# EAGLE design SHIELD_COMPLETO (EAGLE 9.6.2)
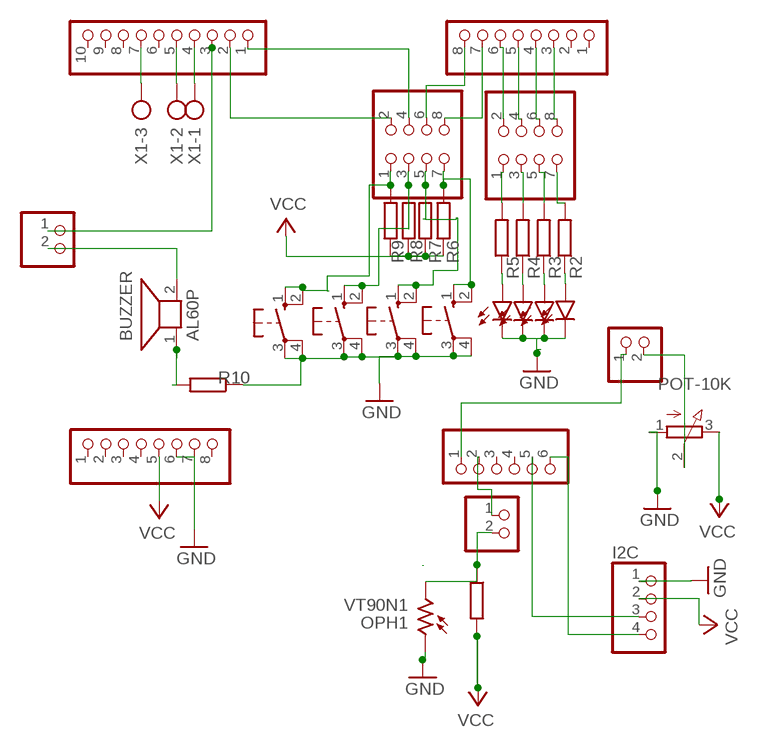
[diagram p0: schematic, sheet 1]

## Parts
AD  6x1F-H8.5  PINHD-1X6  [1X06]
BOT1  10-XX  [B3F-10XX]
BOT2  10-XX  [B3F-10XX]
BOT3  10-XX  [B3F-10XX]
BOT4  10-XX  [B3F-10XX]
BUZZER  AL60P  [AL60P]
I2C  PINHD-1X4  [1X04]
IOH  10x1F-H8.5  PINHD-1X10_ARD  [1X10]
IOL  8x1F-H8.5  PINHD-1X8  [1X08]
J10  PINHD-1X2  [1X02]
JP1  PINHD-2X4  [2X04]
JP2  PINHD-2X4  [2X04]
JP3  PINHD-1X2  [1X02]
JP4  PINHD-1X2  [1X02]
LED1  LED5MM  [LED5MM]
LED2  LED5MM  [LED5MM]
LED3  LED5MM  [LED5MM]
LED4  LED5MM  [LED5MM]
OPH1  VT90N1  [VT900]
POT-10K  3RP/1610N  [3RP/1610N]
POWER  8x1F-H8.5  PINHD-1X8  [1X08]
R1  R-EU_0204/7  [0204/7]
R2  R-EU_0204/7  [0204/7]
R3  R-EU_0204/7  [0204/7]
R4  R-EU_0204/7  [0204/7]
R5  R-EU_0204/7  [0204/7]
R6  R-EU_0204/7  [0204/7]
R7  R-EU_0204/7  [0204/7]
R8  R-EU_0204/7  [0204/7]
R9  R-EU_0204/7  [0204/7]
R10  R-EU_0204/7  [0204/7]
X1  AK300/3  [AK300/3]

## Nets
GND: BOT1.3(P) BOT1.4(P1) BOT2.3(P) BOT2.4(P1) BOT3.3(P) BOT3.4(P1) BOT4.3(P) BOT4.4(P1) I2C.1 LED1.K(C) LED2.K(C) LED3.K(C) LED4.K(C) OPH1.1 POT-10K.1(A) POWER.6 POWER.7 R10.1
N$1: JP1.1 R5.2
N$2: IOL.3 JP1.8
N$3: IOL.4 JP1.6
N$4: IOL.5 JP1.4
N$5: IOL.6 JP1.2
N$6: JP1.3 R4.2
N$7: JP1.5 R3.2
N$8: JP1.7 R2.2
N$9: LED1.A R2.1
N$10: LED2.A R3.1
N$11: LED3.A R4.1
N$12: LED4.A R5.1
N$13: IOL.7 JP2.8
N$14: IOL.8 JP2.6
N$15: IOH.1 JP2.4
N$16: IOH.2 JP2.2
N$17: JP4.2 POT-10K.2(S)
N$18: BOT1.1(S) BOT1.2(S1) JP2.7 R6.2
N$19: JP3.2 OPH1.2 R1.1
N$20: AD.2 JP3.1
N$21: BOT4.1(S) BOT4.2(S1) JP2.1 R9.2
N$22: BOT3.1(S) BOT3.2(S1) JP2.3 R8.2
N$23: BOT2.1(S) BOT2.2(S1) JP2.5 R7.2
N$24: BUZZER.1 R10.2
N$25: IOH.7 X1.3
N$26: IOH.3 J10.1
N$27: IOH.5 X1.2
N$28: AD.5 I2C.3
N$29: AD.6 I2C.4
N$30: AD.1 JP4.1
N$32: IOH.4 X1.1
N$34: BUZZER.2 J10.2
VCC: I2C.2 POT-10K.3(E) POWER.5 R1.2 R6.1 R7.1 R8.1 R9.1
Unconnected: AD.3 AD.4 IOH.6 IOH.8 IOH.9 IOH.10 IOL.1 IOL.2 POWER.1 POWER.2 POWER.3 POWER.4 POWER.8

## Library data of the parts
AD = SmartPrj:PINHD-1X6: PIN HEADER
BOT1-BOT4 = switch-omron:10-XX: OMRON SWITCH; MPN: B3F-1000; OC_FARNELL: 176432; OC_NEWARK: 36M3542
BUZZER = buzzer:AL60P: SPEAKER Source: Buerklin; OC_FARNELL: unknown; OC_NEWARK: unknown
I2C = pinhead:PINHD-1X4: PIN HEADER
IOH = SmartPrj:PINHD-1X10_ARD: PIN HEADER
IOL POWER = SmartPrj:PINHD-1X8: PIN HEADER
J10 JP3 JP4 = pinhead:PINHD-1X2: PIN HEADER
JP1 JP2 = pinhead:PINHD-2X4: PIN HEADER
LED1-LED4 = led:LED: LED OSRAM: - CHIPLED LG R971, LG N971, LY N971, LG Q971, LY Q971, LO R971, LY R971 LH N974, LH R974 LS Q976, LO Q976, LY Q976 LO Q996 - Hyper CHIPLED LW Q18S LB Q993, LB Q99A, LB R99A - SideLED LS A670, LO A670, LY A670, LG A670, LP A670 LB A673, LV A673, LT A673, LW A673 LH A674 LY A675 LS A676, LA A676, LO A676, LY A676, LW A676 LS A679, LY A679, LG A679 - Hyper Micro SIDELED® LS Y876, LA Y876, LO Y876, LY Y876 LT Y87S - SmartLED LW L88C, LW L88S LB L89C, LB L89S, LG L890 LS L89K, LO L89K, LY L89K LS L896, LA L896, LO L896, LY L896 - TOPLED LS T670, LO T670, LY T670, LG T670, LP T670 LSG T670, LSP T670, LSY T670, LOP T670, LYG T670 LG T671, LOG T671, LSG T671 LB T673, LV T673, LT T673, LW T673 LH T674 LS T676, LA T676, LO T676, LY T676, LB T676, LH T676, LSB T676, LW T676 LB T67C, LV T67C, LT T67C, LS T67K, LO T67K, LY T67K, LW E67C LS E67B, LA E67B, LO E67B, LY E67B, LB E67C, LV E67C, LT E67C LW T67C LS T679, LY T679, LG T679 LS T770, LO T770, LY T770, LG T770, LP T770 LB T773, LV T773, LT T773, LW T773 LH T774 LS E675, LA E675, LY E675, LS T675 LS T776, LA T776, LO T776, LY T776, LB T776 LHGB T686 LT T68C, LB T68C - Hyper Mini TOPLED® LB M676 - Mini TOPLED Santana® LG M470 LS M47K, LO M47K, LY M47K Source: http://www.osram.convergy.de LUXEON: - LUMILED® LXK2-PW12-R00, LXK2-PW12-S00, LXK2-PW14-U00, LXK2-PW14-V00 LXK2-PM12-R00, LXK2-PM12-S00, LXK2-PM14-U00 LXK2-PE12-Q00, LXK2-PE12-R00, LXK2-PE12-S00, LXK2-PE14-T00, LXK2-PE14-U00 LXK2-PB12-K00, LXK2-PB12-L00, LXK2-PB12-M00, LXK2-PB14-N00, LXK2-PB14-P00, LXK2-PB14-Q00 LXK2-PR12-L00, LXK2-PR12-M00, LXK2-PR14-Q00, LXK2-PR14-R00 LXK2-PD12-Q00, LXK2-PD12-R00, LXK2-PD12-S00 LXK2-PH12-R00, LXK2-PH12-S00 LXK2-PL12-P00, LXK2-PL12-Q00, LXK2-PL12-R00 Source: www.luxeon.com KINGBRIGHT: KA-3528ASYC Source: www.kingbright.com
OPH1 = photo-elements:VT9: Photoconductive Cell VT900 Series Source: http://optoelectronics.perkinelmer.com/content/Datasheets/DTS_vt900seriesdatasheet.pdf
POT-10K = pot:3RP/1610N: 16mm Potentiometer one level Source: http://www.alphapotentiometers.net/html/16mm_pot_2.html
R1-R10 = rcl:R-EU_: RESISTOR, European symbol; SPICEPREFIX: R
X1 = con-ptr500:AK300/3: CONNECTOR; OC_FARNELL: unknown; OC_NEWARK: unknown

## Net classes
0 default: width 0.254 mm, clearance 0.254 mm
1 power: width 0.61 mm, drill 0.61 mm, clearance 0.254 mm
2 gnd: width 0.305 mm, drill 0.559 mm, clearance 0.254 mm
3 usbvcc: width 0.508 mm, drill 0.61 mm, clearance 0.254 mm
4 aref: width 0.406 mm, drill 0.61 mm, clearance 0.254 mm

## Board
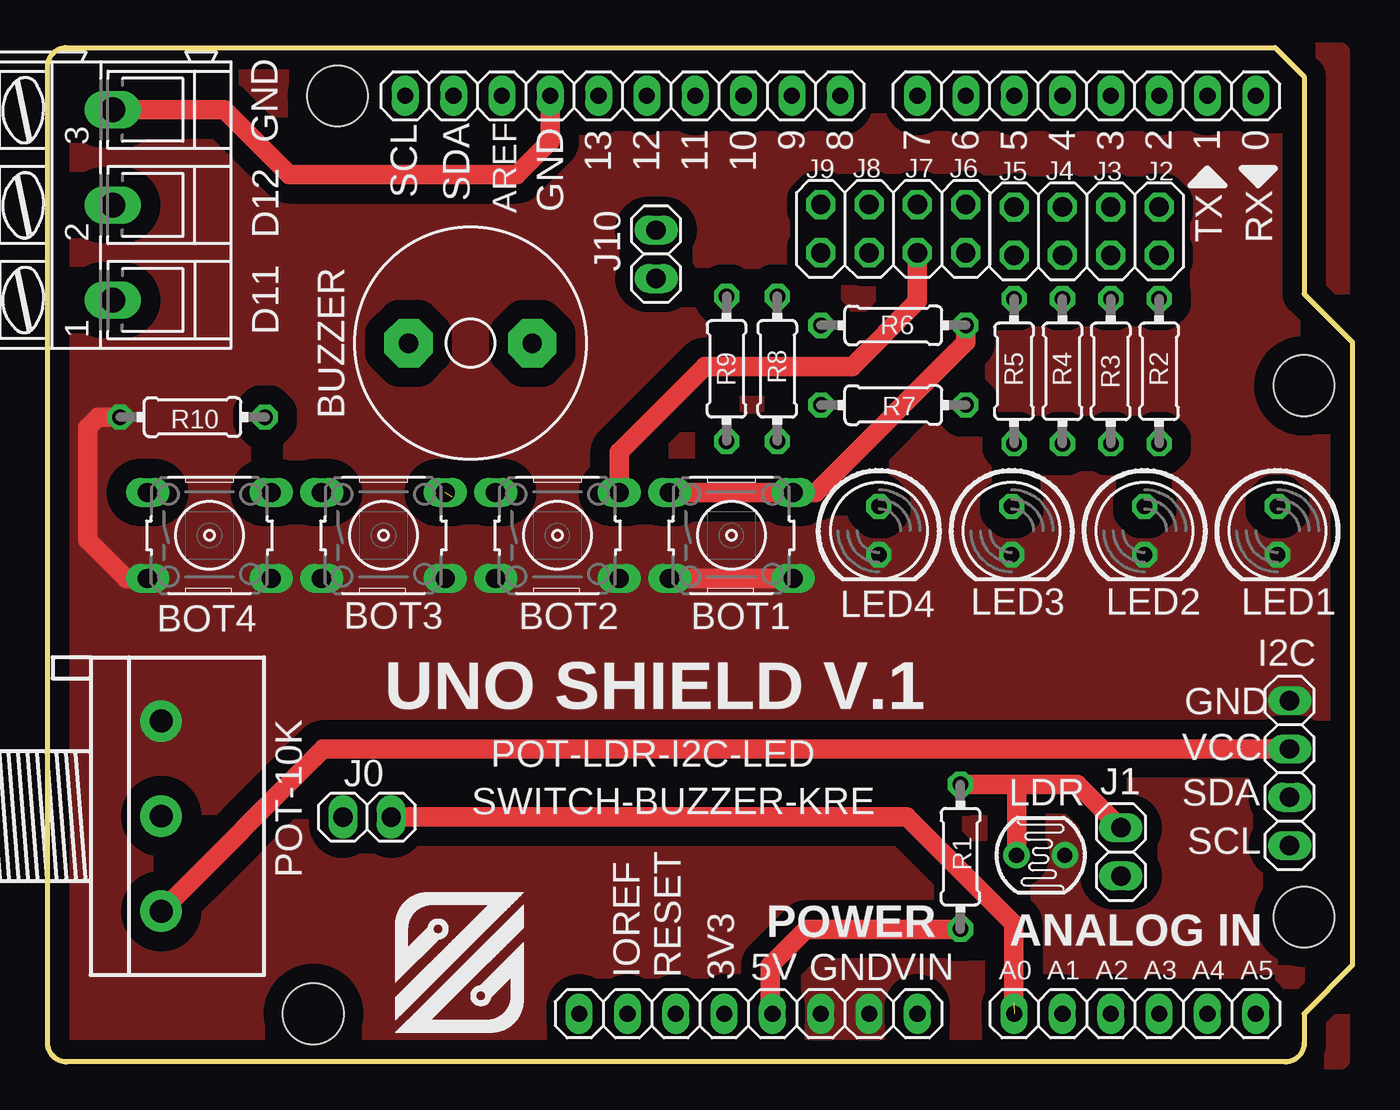
[diagram p1: board, top side]
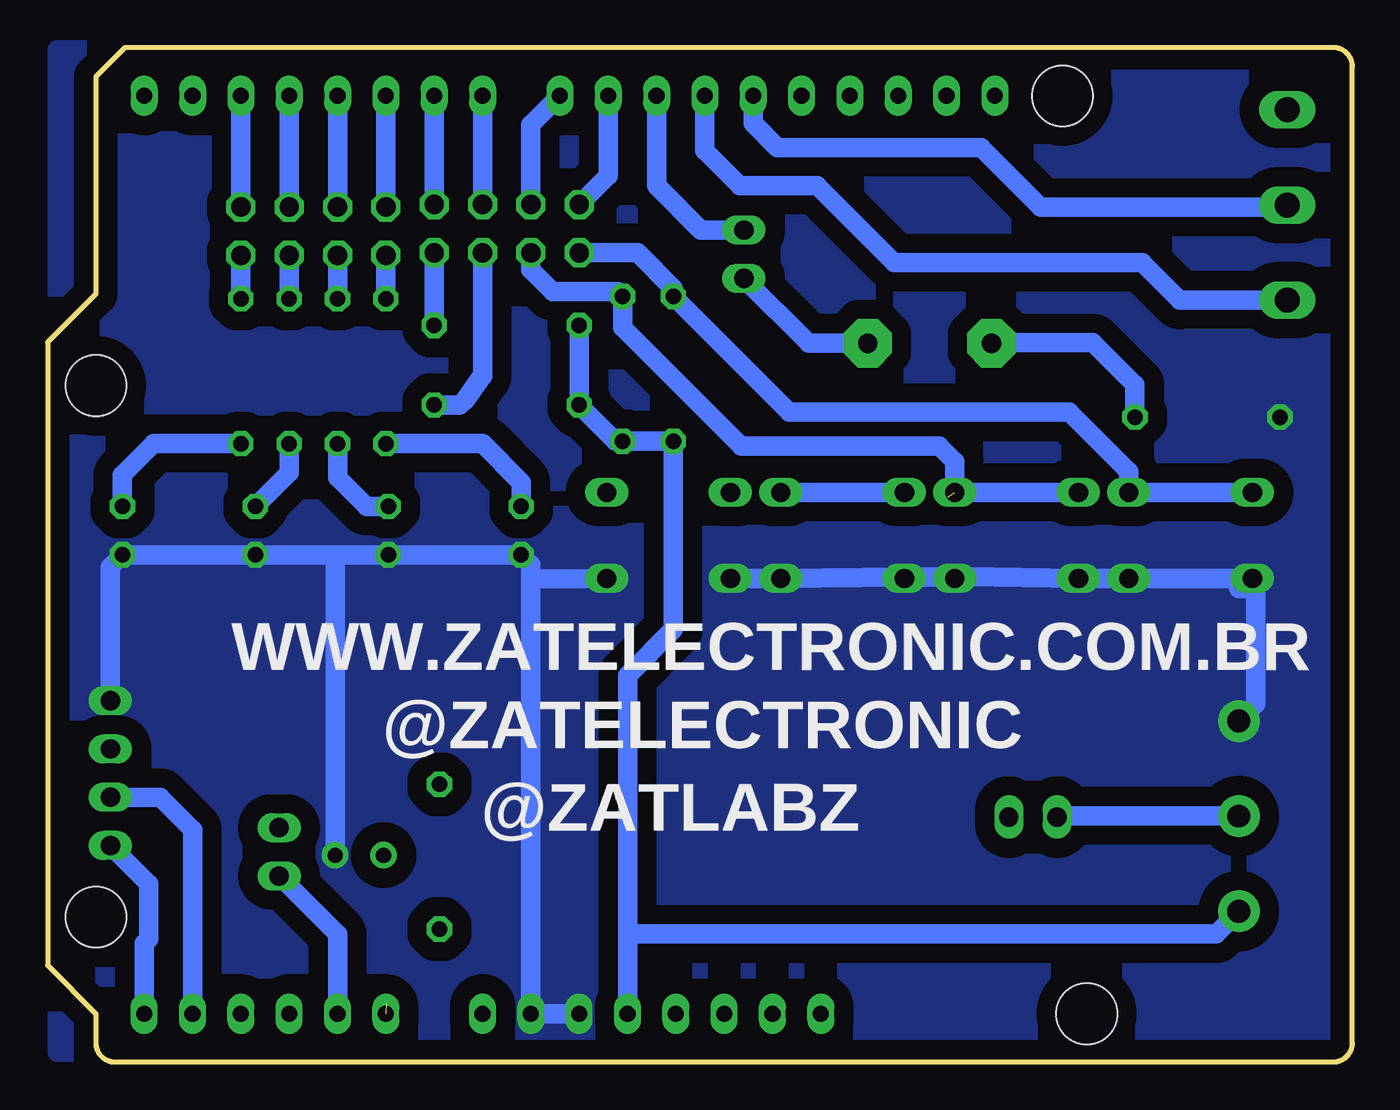
[diagram p2: board, bottom side, seen from below]

Size 68.58 x 53.34 mm. Coordinates in mm from the lower left corner, seen from the top.
Outline: 64.52,53.34 66.04,51.82 66.04,40.39 68.58,37.85 68.58,5.08 66.04,2.54 66.04,1 arc-90 65.04,0 1,0 arc-90 0,1 0,52.34 arc-90 1,53.34 64.52,53.34
Copper layers (1*16): Top 0.035mm / dielectric 1.5mm / Bottom 0.035mm
Design rules "default *": minimum track width 40mil, minimum drill 22mil, track to track 10mil, track to pad 10mil, pad to pad 10mil, via to via 12mil, smd to smd 8mil, copper to edge 26mil, drill to drill 12mil, minimum pad ring 10mil, minimum via ring 10mil, stop-mask expansion 1mil, vias tented up to drill 30mil, thermal gap 10mil
Holes 3.2 mm at 66.04,35.56 66.04,7.62 15.24,50.8 13.97,2.54

### Footprints (pad centres in the part's own frame; a part is rotated, then mirrored left to right if it is on the bottom)
1X06 = drill 0.85 pad 1.422 long: 1 -6.35,0; 2 -3.81,0; 3 -1.27,0; 4 1.27,0; 5 3.81,0; 6 6.35,0
B3F-10XX = drill 1.016 long: 1 -3.251,2.261; 2 3.251,2.261; 3 -3.251,-2.261; 4 3.251,-2.261
AL60P = drill 1.016 pad 2.54 octagon: 1 -3.251,0; 2 3.251,0
1X04 = drill 1.016 long: 1 -3.81,0; 2 -1.27,0; 3 1.27,0; 4 3.81,0
1X10 = drill 0.85 pad 1.422 long: 1 -11.43,0; 2 -8.89,0; 3 -6.35,0; 4 -3.81,0; 5 -1.27,0; 6 1.27,0; 7 3.81,0; 8 6.35,0; 9 8.89,0; 10 11.43,0
1X08 = drill 0.85 pad 1.422 long: 1 -8.89,0; 2 -6.35,0; 3 -3.81,0; 4 -1.27,0; 5 1.27,0; 6 3.81,0; 7 6.35,0; 8 8.89,0
1X02 = drill 1.016 long: 1 -1.27,0; 2 1.27,0
2X04 = drill 1.016 octagon: 1 -3.81,-1.27; 2 -3.81,1.27; 3 -1.27,-1.27; 4 -1.27,1.27; 5 1.27,-1.27; 6 1.27,1.27; 7 3.81,-1.27; 8 3.81,1.27
LED5MM = drill 0.813 octagon: A -1.27,0; K 1.27,0
VT900 = drill 0.8 pad 1.4: 1 -1.27,0; 2 1.27,0
3RP/1610N = drill 1.2 pad 2.184: 1 -5,0; 2 0,0; 3 5,0
0204/7 = drill 0.813 octagon: 1 -3.81,0; 2 3.81,0
AK300/3 = drill 1.321 long: 1 -5.004,0; 2 0,0; 3 5.004,0

### Placement (x,y rotation side)
AD  57.15,2.54 0 top
BOT1  35.94,27.69 0 top
BOT2  26.8,27.69 0 top
BOT3  17.65,27.69 0 top
BOT4  8.51,27.69 0 top
BUZZER  22.23,37.8 0 top
I2C  65.28,15.19 270 top
IOH  30.23,50.8 180 top
IOL  54.61,50.8 180 top
J10  31.98,42.47 270 top
JP1  54.61,43.69 0 top
JP2  44.45,43.81 0 top
JP3  56.41,11.05 90 top
JP4  16.79,12.88 180 top
LED1  64.64,27.94 270 top
LED2  57.66,27.94 270 top
LED3  50.67,27.94 270 top
LED4  43.69,27.94 270 top
OPH1  52.2,10.87 180 top
POT-10K  5.97,12.93 270 top
POWER  36.83,2.54 0 top
R1  47.98,10.79 270 top
R2  58.42,36.32 90 top
R3  55.88,36.32 90 top
R4  53.34,36.32 90 top
R5  50.8,36.32 90 top
R6  44.45,38.73 0 top
R7  44.45,34.54 0 top
R8  38.35,36.45 90 top
R9  35.69,36.45 90 top
R10  7.62,33.91 0 top
U$1  [SIMBOLO_MEDIO]  17.88,0.94 0 top
X1  3.43,45.06 90 top

### Tracks (layer width: path | path; a pad name or v marks a point on that pad's centre or on a via)
GND
  Top 1.016: BOT1.3 BOT1.4 | R10.1 2.67,33.91 2.11,33.35 2.11,27.46 4.14,25.43 BOT4.3
  Bottom 1.016: 53.67,26.67 LED3.K LED4.K 43.18,26.16 43.18,25.4 | 53.67,26.67 54.85,26.67 | 54.48,26.67 LED2.K LED1.K 65.28,26.04 I2C.1 | 43.18,25.4 POWER.7 POWER.6 | BOT4.3 BOT4.4 BOT3.3 20.32,25.53 BOT3.4 | BOT2.3 21.46,25.53 BOT2.4 BOT1.3 | BOT1.4 43.18,25.4 | POT-10K.1 5.08,18.82 5.08,24.89 5.97,24.89 | OPH1.1 53.47,26.47 53.67,26.67
  pour Bottom (isolate 1.016, no thermals): 0.38,53.21 0.38,0.51 68.07,0.51 68.07,53.21
  pour Top (isolate 1.016, no thermals): 0.25,53.09 0.25,0.13 67.94,0.13 67.94,53.09
N$1
  Bottom 1.016: JP1.1 R5.2
N$2
  Bottom 1.016: IOL.3 JP1.8
N$3
  Bottom 1.016: JP1.6 IOL.4
N$4
  Bottom 1.016: JP1.4 IOL.5
N$5
  Bottom 1.016: JP1.2 IOL.6
N$6
  Bottom 1.016: JP1.3 R4.2
N$7
  Bottom 1.016: JP1.5 R3.2
N$8
  Bottom 1.016: JP1.7 R2.2
N$9
  Bottom 1.016: R2.1 62.99,32.51 64.64,30.86 LED1.A
N$10
  Bottom 1.016: LED2.A 55.88,30.99 R3.1
N$11
  Bottom 1.016: LED3.A 51.82,29.21 53.34,30.73 R4.1
N$12
  Bottom 1.016: LED4.A 43.69,30.48 45.72,32.51 R5.1
N$13
  Bottom 1.016: JP2.8 IOL.7
N$14
  Bottom 1.016: JP2.6 IOL.8
N$15
  Bottom 1.016: JP2.4 43.18,49.28 IOH.1
N$16
  Bottom 1.016: JP2.2 39.12,46.61 IOH.2
N$17
  Bottom 1.016: POT-10K.2 15.47,12.93 JP4.2
N$18
  Top 1.016: R6.2 48.26,37.85 40.36,29.95 BOT1.2 BOT1.1
  Bottom 1.016: R6.2 JP2.7
N$19
  Top 1.016: JP3.2 54.13,14.61 R1.1 50.93,14.61 OPH1.2
N$20
  Bottom 1.016: AD.2 53.34,6.71 JP3.1
N$21
  Bottom 1.016: JP2.1 37.57,42.55 35.69,40.66 R9.2 29.59,34.16 14.88,34.16 11.76,31.04 BOT4.2 BOT4.1
N$22  (1 unrouted)
  Bottom 1.016: JP2.3 43.18,41.66 42.04,40.51 38.61,40.51 R8.2 38.35,38.61 32.13,32.38 21.72,32.38 20.9,31.57 BOT3.2 | BOT3.1 21.03,29.95 21.26,29.72
N$23
  Top 1.016: BOT2.2 30.05,32.08 34.54,36.58 42.29,36.58 45.72,40.01 JP2.5
  Bottom 1.016: R7.2 46.91,34.54 46.64,34.81 45.85,35.94 45.72,36.07 JP2.5 | BOT2.1 BOT2.2
N$24
  Bottom 1.016: R10.2 11.43,35.61 13.64,37.82 18.95,37.82 BUZZER.1
N$25
  Top 1.016: X1.3 9.3,50.06 12.7,46.66 24.66,46.66 26.42,48.41 IOH.7
N$26
  Bottom 1.016: J10.1 34.24,43.74 36.58,46.08 IOH.3
N$27
  Bottom 1.016: X1.2 3.53,44.96 16.38,44.96 19.51,48.08 30.23,48.08 31.5,49.35 IOH.5
N$28
  Bottom 1.016: AD.5 60.96,12.22 62.66,13.92 I2C.3
N$29
  Bottom 1.016: AD.6 63.5,6.25 63.27,6.47 63.27,9.37 I2C.4
N$30  (1 unrouted)
  Top 1.016: JP4.1 45.16,12.88 50.77,7.26 50.77,3.07
N$32
  Bottom 1.016: X1.1 9.07,40.06 11.05,42.04 24.08,42.04 28.12,46.08 32.21,46.08 34.04,47.9 IOH.4
N$34
  Bottom 1.016: BUZZER.2 28.57,37.8 J10.2
VCC
  Top 1.016: POWER.5 37.97,2.67 37.97,5.08 39.88,6.99 R1.2 | I2C.2 14.5,16.46 POT-10K.3
  Bottom 1.016: R6.1 R7.1 38.73,32.64 R8.1 R9.1 35.69,22.73 38.1,20.32 38.1,6.73 | POWER.5 38.1,6.73 | 38.1,6.73 7.17,6.73 POT-10K.3

### Text on the board
tPlace: 13 | 12 | 11 | 10 | 9 | 8 | 7 | 6 | 5 | 4 | 3 | 2 | 1 | 0
tNames: AREF | GND | GND | J9 | J8 | J7 | J6 | J5 | J4 | J3 | J2 | SCL | SDA | D12 | TX | RX | D11 | I2C | UNO SHIELD V.1 | GND | POT-LDR-I2C-LED | VCC | J0 | J1 | SWITCH-BUZZER-KRE | LDR | SDA | SCL | ANALOG IN | IOREF | RESET | 3V3 | 5V | GND | VIN | A0 | A1 | A2 | A3 | A4 | A5
bNames: WWW.ZATELECTRONIC.COM.BR | @ZATELECTRONIC | @ZATLABZ
214bmp: D:/SmartProjects/Snc/a4_bn_logo2.bmp